# EasyEDA schematic SCH_power-distribution_2026-04-19.json
TITLE: Sheet_1; REV: 1.0; Date: 2026-04-05; Sheet: 1/1; Drawn By: bosyarafa6969; Company: Your Company
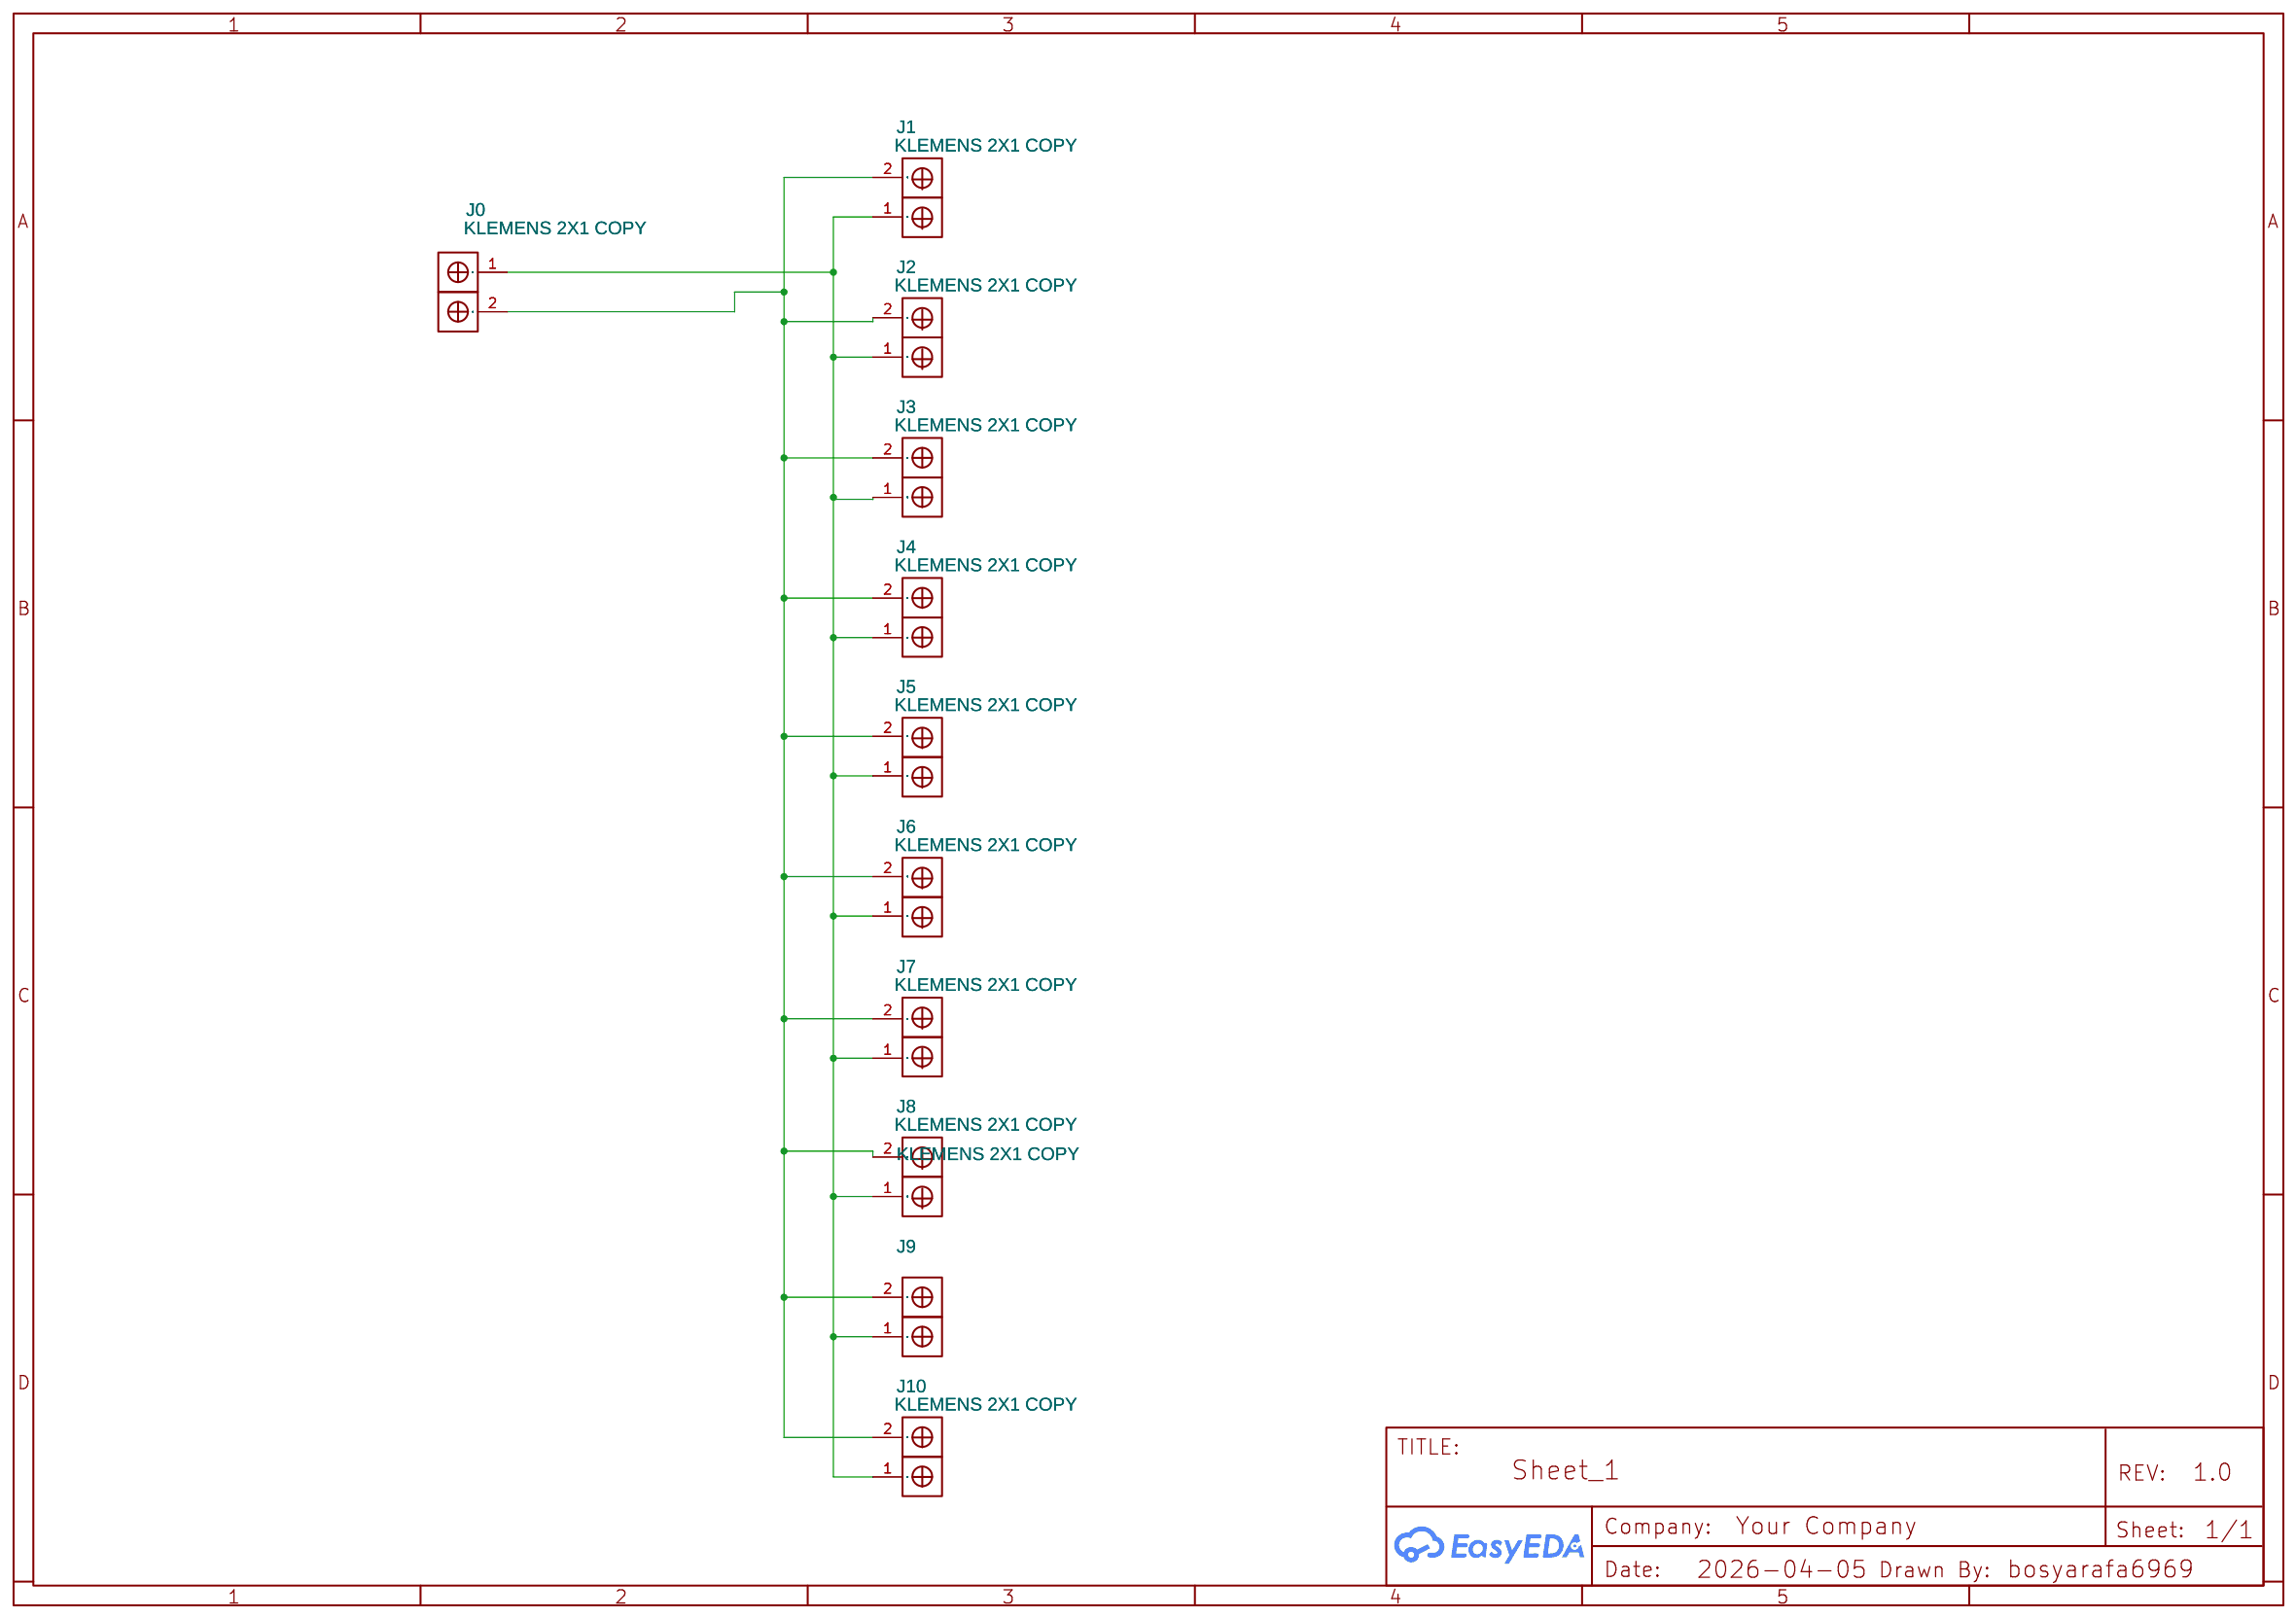
[diagram p0: schematic sheet]

## Parts
J0  KLEMENS 2X1 COPY  [TERMINALBLOCK_METZCONNECT:TERMINALBLOCK_METZCONNECT_360271_1X01_HORIZONTAL_SCREWM3.0_BOXED]
J1  KLEMENS 2X1 COPY  [TERMINALBLOCK_METZCONNECT:TERMINALBLOCK_METZCONNECT_360271_1X01_HORIZONTAL_SCREWM3.0_BOXED]
J2  KLEMENS 2X1 COPY  [TERMINALBLOCK_METZCONNECT:TERMINALBLOCK_METZCONNECT_360271_1X01_HORIZONTAL_SCREWM3.0_BOXED]
J3  KLEMENS 2X1 COPY  [TERMINALBLOCK_METZCONNECT:TERMINALBLOCK_METZCONNECT_360271_1X01_HORIZONTAL_SCREWM3.0_BOXED]
J4  KLEMENS 2X1 COPY  [TERMINALBLOCK_METZCONNECT:TERMINALBLOCK_METZCONNECT_360271_1X01_HORIZONTAL_SCREWM3.0_BOXED]
J5  KLEMENS 2X1 COPY  [TERMINALBLOCK_METZCONNECT:TERMINALBLOCK_METZCONNECT_360271_1X01_HORIZONTAL_SCREWM3.0_BOXED]
J6  KLEMENS 2X1 COPY  [TERMINALBLOCK_METZCONNECT:TERMINALBLOCK_METZCONNECT_360271_1X01_HORIZONTAL_SCREWM3.0_BOXED]
J7  KLEMENS 2X1 COPY  [TERMINALBLOCK_METZCONNECT:TERMINALBLOCK_METZCONNECT_360271_1X01_HORIZONTAL_SCREWM3.0_BOXED]
J8  KLEMENS 2X1 COPY  [TERMINALBLOCK_METZCONNECT:TERMINALBLOCK_METZCONNECT_360271_1X01_HORIZONTAL_SCREWM3.0_BOXED]
J9  KLEMENS 2X1 COPY  [TERMINALBLOCK_METZCONNECT:TERMINALBLOCK_METZCONNECT_360271_1X01_HORIZONTAL_SCREWM3.0_BOXED]
J10  KLEMENS 2X1 COPY  [TERMINALBLOCK_METZCONNECT:TERMINALBLOCK_METZCONNECT_360271_1X01_HORIZONTAL_SCREWM3.0_BOXED]

## Library data of the parts
J0-J10 = KLEMENS 2X1 COPY: Generic screw terminal, single row, 01x01, script generated (kicad-library-utils/schlib/autogen/connector/); Symbol: Connector_Screw_Terminal_01x01; Device: Connector_Screw_Terminal_01x01; Add into BOM: yes; Convert to PCB: yes; Origin Footprint: TerminalBlock_MetzConnect_360271_1x01_Horizontal_ScrewM3.0_Boxed; Comment: Connector_Screw_Terminal_01x01; Contributor: fjju1212

## Nets
Net-(J0-1): J0.1(Gnd) J1.1(Gnd) J2.1(Gnd) J3.1(Gnd) J4.1(Gnd) J5.1(Gnd) J6.1(Gnd) J7.1(Gnd) J8.1(Gnd) J9.1(Gnd) J10.1(Gnd)
Net-(J0-2): J0.2(Vcc) J1.2(Vcc) J2.2(Vcc) J3.2(Vcc) J4.2(Vcc) J5.2(Vcc) J6.2(Vcc) J7.2(Vcc) J8.2(Vcc) J9.2(Vcc) J10.2(Vcc)
